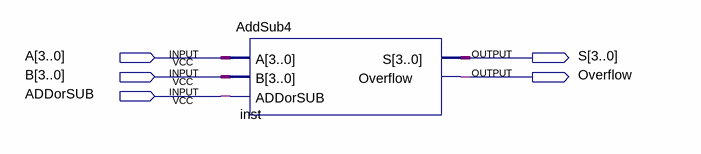
[diagram p0: schematic sheet]
// Quartus schematic AddSubDemo.bdf as structural Verilog: 1 symbols, 5 pins
module AddSubDemo (
  input  [3:0] A,
  input  [3:0] B,
  input  ADDorSUB,
  output [3:0] S,
  output Overflow
);

  AddSub4 inst (.A(A), .B(B), .ADDorSUB(ADDorSUB), .S(S), .Overflow(Overflow));
endmodule
